# Altium schematic sheet 02_FPGA_Interface.SchDoc
size A; SheetNumber: 2; SheetTotal: 6
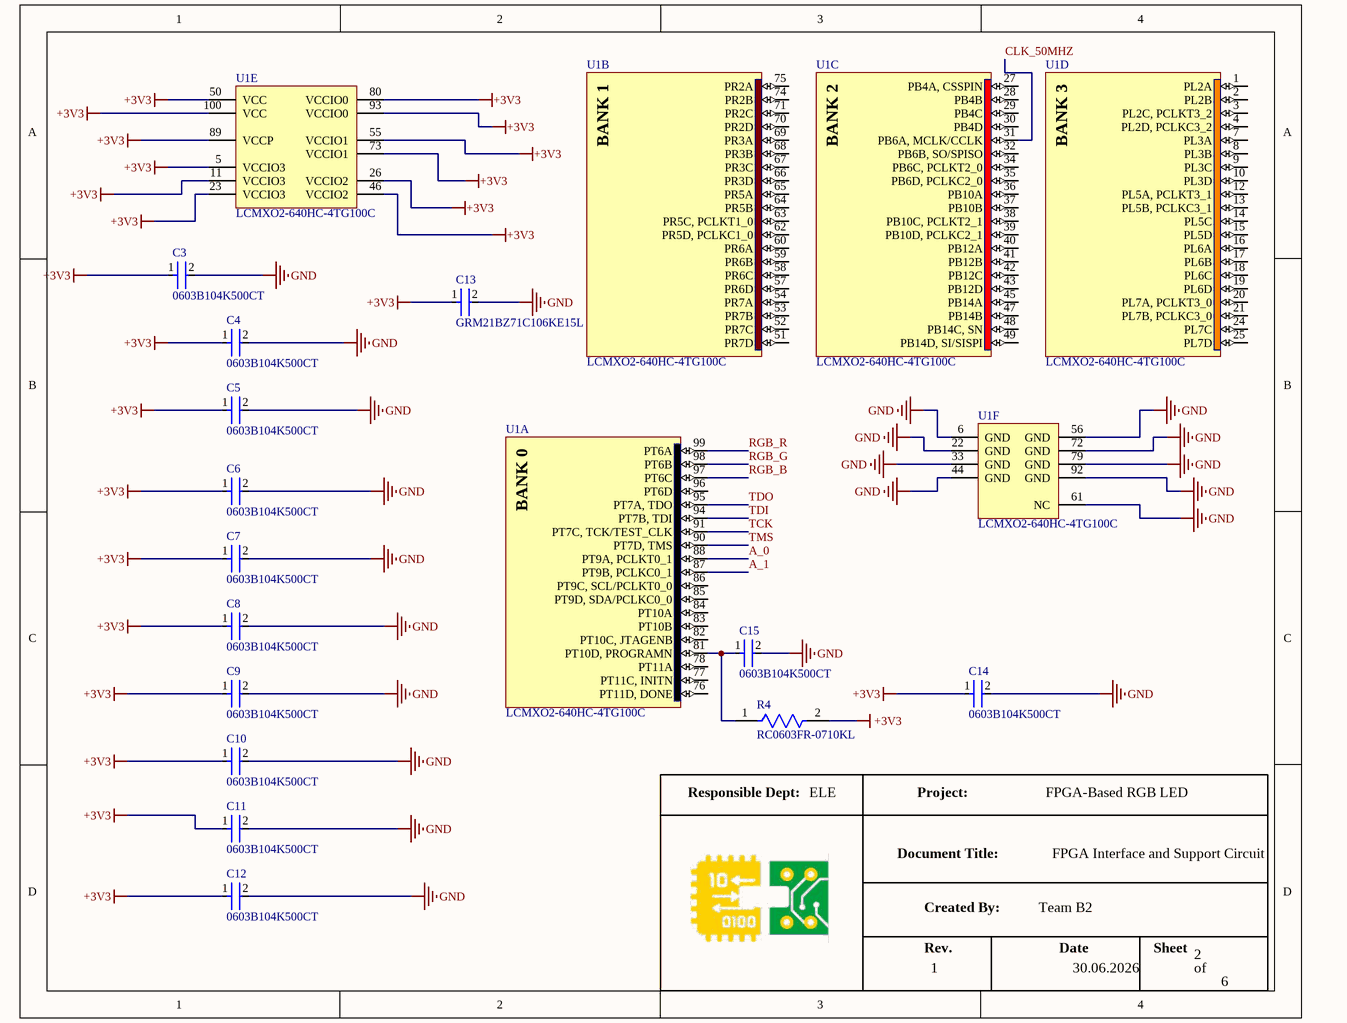
[diagram p0: 02_FPGA_Interface.SchDoc]

## Parts
C3  0603B104K500CT  [FP-0603B104K500CT-IPC_C]
C4  0603B104K500CT  [FP-0603B104K500CT-IPC_C]
C5  0603B104K500CT  [FP-0603B104K500CT-IPC_C]
C6  0603B104K500CT  [FP-0603B104K500CT-IPC_C]
C7  0603B104K500CT  [FP-0603B104K500CT-IPC_C]
C8  0603B104K500CT  [FP-0603B104K500CT-IPC_C]
C9  0603B104K500CT  [FP-0603B104K500CT-IPC_C]
C10  0603B104K500CT  [FP-0603B104K500CT-IPC_C]
C11  0603B104K500CT  [FP-0603B104K500CT-IPC_C]
C12  0603B104K500CT  [FP-0603B104K500CT-IPC_C]
C13  GRM21BZ71C106KE15L  [FP-GRM21B-0_2-e0_2_0_7-IPC_C]
C14  0603B104K500CT  [FP-0603B104K500CT-IPC_C]
C15  0603B104K500CT  [FP-0603B104K500CT-IPC_C]
R4  RC0603FR-0710KL  [FP-RC0603-0_55-IPC_C]
U1  LCMXO2-640HC-4TG100C  [TQFP100_M]  (parts A,B,C,D,E,F of 6)

## Nets
 +3V3: C3.1 C4.1 C5.1 C6.1 C7.1 C8.1 C9.1 C10.1 C11.1 C12.1 C13.1 C14.1 R4.2 U1.5(VCCIO3) U1.11(VCCIO3) U1.23(VCCIO3) U1.26(VCCIO2) U1.46(VCCIO2) U1.50(VCC) U1.55(VCCIO1) U1.73(VCCIO1) U1.80(VCCIO0) U1.89(VCCP) U1.93(VCCIO0) U1.100(VCC)  [also labelled +3V3]
GND: C3.2 C4.2 C5.2 C6.2 C7.2 C8.2 C9.2 C10.2 C11.2 C12.2 C13.2 C14.2 C15.2 U1.6(GND) U1.22(GND) U1.33(GND) U1.44(GND) U1.56(GND) U1.61(NC) U1.72(GND) U1.79(GND) U1.92(GND)
A_0: U1.88(PT9A,_PCLKT0_1)
A_1: U1.87(PT9B,_PCLKC0_1)
CLK_50MHZ: U1.31(PB6A,_MCLK/CCLK)
RGB_B: U1.97(PT6C)
RGB_G: U1.98(PT6B)
RGB_R: U1.99(PT6A)
TCK: U1.91(PT7C,_TCK/TEST_CLK)
TDI: U1.94(PT7B,_TDI)
TDO: U1.95(PT7A,_TDO)
TMS: U1.90(PT7D,_TMS)
NetC15_1: C15.1 R4.1 U1.81(PT10D,_PROGRAMN)

Not connected (* = marked no-connect by the designer): U1 1(PL2A) 2(PL2B) 3(PL2C,_PCLKT3_2) 4(PL2D,_PCLKC3_2) 7(PL3A) 8(PL3B) 9(PL3C) 10(PL3D) 12(PL5A,_PCLKT3_1) 13(PL5B,_PCLKC3_1) 14(PL5C) 15(PL5D) 16(PL6A) 17(PL6B) 18(PL6C) 19(PL6D) 20(PL7A,_PCLKT3_0) 21(PL7B,_PCLKC3_0) 24(PL7C) 25(PL7D) 27(PB4A,_CSSPIN) 28(PB4B) 29(PB4C) 30(PB4D) 32(PB6B,_SO/SPISO) 34(PB6C,_PCLKT2_0) 35(PB6D,_PCLKC2_0) 36(PB10A) 37(PB10B) 38(PB10C,_PCLKT2_1) 39(PB10D,_PCLKC2_1) 40(PB12A) 41(PB12B) 42(PB12C) 43(PB12D) 45(PB14A) 47(PB14B) 48(PB14C,_SN) 49(PB14D,_SI/SISPI) 51(PR7D) 52(PR7C) 53(PR7B) 54(PR7A) 57(PR6D) 58(PR6C) 59(PR6B) 60(PR6A) 62(PR5D,_PCLKC1_0) 63(PR5C,_PCLKT1_0) 64(PR5B) 65(PR5A) 66(PR3D) 67(PR3C) 68(PR3B) 69(PR3A) 70(PR2D) 71(PR2C) 74(PR2B) 75(PR2A) 76(PT11D,_DONE) 77(PT11C,_INITN) 78(PT11A) 82(PT10C,_JTAGENB) 83(PT10B) 84(PT10A) 85(PT9D,_SDA/PCLKC0_0) 86(PT9C,_SCL/PCLKT0_0) 96(PT6D)

## Notes on the sheet
- Responsible Dept:
- ELE
- Project:
- FPGA-Based RGB LED
- Document Title:
- Created By:
- Team B2
- FPGA Interface and Support Circuit
- Rev.
- 1
- Date
- 30.06.2026
- Sheet
- of
- 2
- 6
- (in symbol CMP-0111-00271-1, part A) BANK 0
- (in symbol CMP-0111-00271-1, part B) BANK 1
- (in symbol CMP-0111-00271-1, part C) BANK 2
- (in symbol CMP-0111-00271-1, part D) BANK 3

## Library data of the parts
C3-C12 C14 C15 = CMP-45632-000007-1: CAP CER 0.1UF 50V X7R 0603; Tolerance: 10%; Capacitance: 100nF; Radiation Hardening: No; Depth: 0.8mm; Length: 1.6mm; Voltage Rating: 50V; Dielectric: X7R; Case/Package: 0603; RoHS Compliant: Yes; Case Code (Metric): 1608; Voltage Rating (DC): 50V; Min Operating Temperature: -55°C; Series: -; Max Operating Temperature: 125°C; Lead Free: Lead Free; Case Code (Imperial): 0603; Packaging: Tape and Reel
C13 = CMP-06035-007712-1: Chip Multilayer Ceramic Capacitors for General Purpose, 0805, 10uF, X7R, 15%, 10%, 16V
R4 = CMP-2100-03664-2: RES 10K OHM 1% 1/10W 0603; Voltage Rating: 75V; Voltage Rating (DC): 50V; Resistance: 10kR; Power Rating: 100mW; Temperature Coefficient: 100ppm/°C; Depth: 0.8mm; Termination: SMD/SMT; Resistor Type: Thick Film; Series: RC; Construction: Rectangular; Features: Moisture Resistant; Packaging: Tape and Reel; Min Operating Temperature: -55°C; Number of Terminations: 2; Lead Pitch: 0.3mm; RoHS Compliant: Yes; Case/Package: 0603; Resistance Tolerance: 1%; Military Standard: Not; Weight: 7.1E-05oz; Number of Pins: 2; Tolerance: 1%; Length: 1.6mm; Case Code (Imperial): 0603; Lead Free: Lead Free; Width: 0.8mm; Max Power Dissipation: 100mW; Height: 0.45mm; Max Operating Temperature: 155°C; Case Code (Metric): 1608; Size Code: 0603
U1 = CMP-0111-00271-1: MachXO2 High Performance CPLD with 640 LUTs, Voltage Regulator, 2.5V/3.3V, 100-pin TQFP, Speed Grade-4, Commercial Grade, Halogen Free (RoHS); PackageDescription: 100-Pin Thin Quad Flat Pack (TQFP100); PackageVersion: ver02.6, Nov-2010; PackageReference: TQFP100; Code_JEDEC: MS-026-BED; DatasheetVersion: ver01.0, Nov-2010